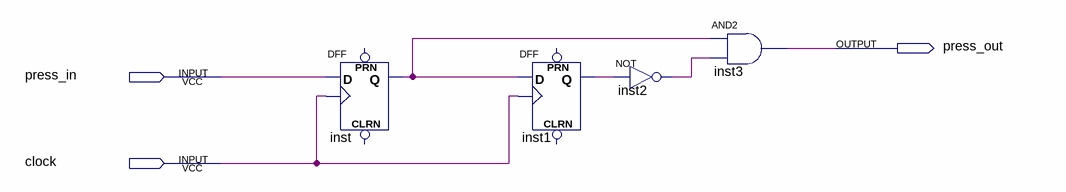
[diagram p0: schematic sheet]
// Quartus schematic debouncing.bdf as structural Verilog: 4 symbols, 3 pins
module debouncing (
  input  press_in,
  input  clock,
  output press_out
);

  wire inst1_q, inst2_out, inst_q;

  DFF inst (.CLK(clock), .D(press_in), .Q(inst_q));  // open: CLRN, PRN
  DFF inst1 (.CLK(clock), .D(inst_q), .Q(inst1_q));  // open: CLRN, PRN
  not inst2 (inst2_out, inst1_q);
  and inst3 (press_out, inst_q, inst2_out);
endmodule
